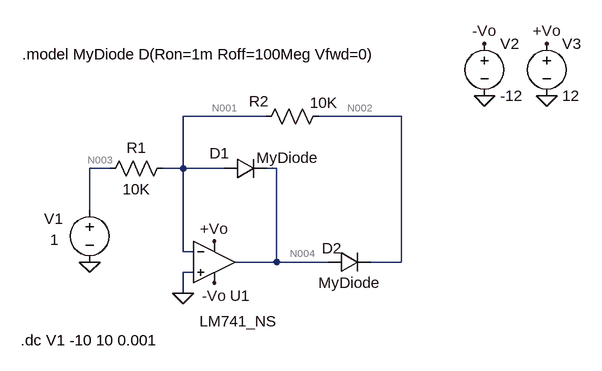
[diagram p0: schematic lab3_4.asc]
* lab3_4.asc
V1 N003 0 1
V2 -Vo 0 -12
V3 +Vo 0 12
R1 N001 N003 10K
R2 N002 N001 10K
* U1: LM741_NS (symbol AutoGenerated\LM741_NS not available, pins judged from their places): In+=0 In-=N001 V+=+Vo V-=-Vo OUT=N004
D1 N001 N004 MyDiode
D2 N004 N002 MyDiode
.model D D
.lib standard.dio
.model MyDiode D(Ron=1m Roff=100Meg Vfwd=0)
.dc V1 -10 10 0.001
.backanno
.end

* Results of the author's LTspice run, read from the files saved beside the schematic
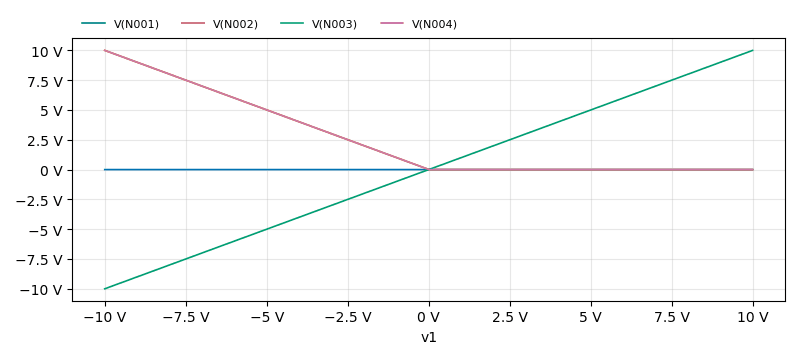
[diagram p1: DC transfer characteristic of lab3_4.asc, plotted from the saved traces]
* DC transfer characteristic, 1 run:
*   V(N001): 949.6 µV at v1=-10 V, 1 mV at v1=10 V, min 949.6 µV, max 1 mV
*   V(N002): 10 V at v1=-10 V, 1 mV at v1=10 V, min 1 mV, max 10 V
*   V(N003): -10 V at v1=-10 V, 10 V at v1=10 V, min -10 V, max 10 V
*   V(N004): 10 V at v1=-10 V, 999.5 µV at v1=10 V, min 999.5 µV, max 10 V